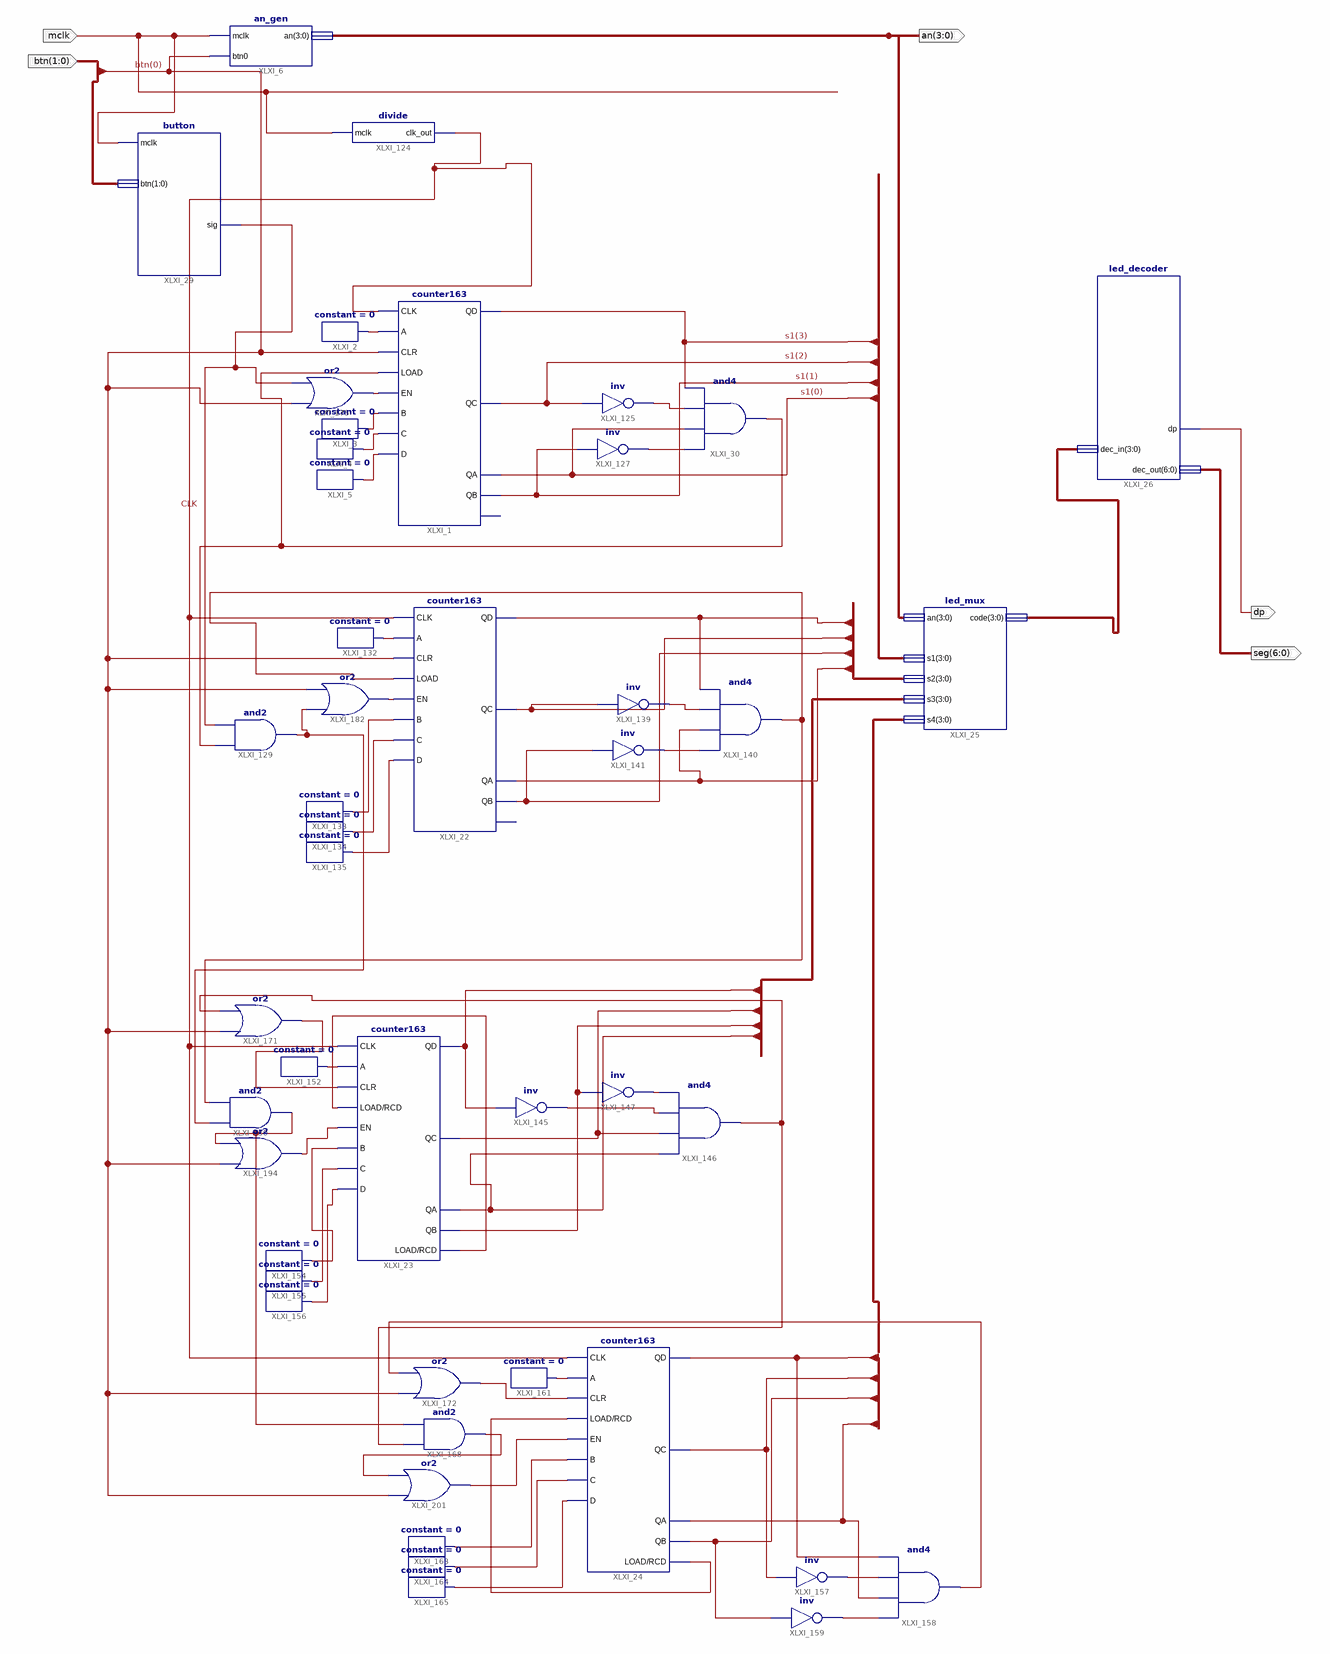
[diagram p0: schematic sheet 1]
// Xilinx ISE schematic timer.sch (spartan3e) as structural Verilog: 46 symbols, 5 ports
module timer (
  input  [1:0] btn,
  input  mclk,
  output [3:0] an,
  output dp,
  output [6:0] seg
);

  wire CLK, XLXN_4, XLXN_5, XLXN_6, XLXN_354, XLXN_396, XLXN_397, XLXN_410, XLXN_415, XLXN_416, XLXN_417,
       XLXN_419, XLXN_420, XLXN_429, XLXN_435, XLXN_437, XLXN_440, XLXN_441, XLXN_442, XLXN_443, XLXN_447,
       XLXN_448, XLXN_453, XLXN_454, XLXN_455, XLXN_456, XLXN_462, XLXN_467, XLXN_474, XLXN_477, XLXN_485,
       XLXN_487, XLXN_488, XLXN_489, XLXN_505, XLXN_513, XLXN_523, XLXN_538, XLXN_540, XLXN_559, XLXN_560;
  wire [3:0] s1, s2, s3, s4, XLXN_27;

  an_gen XLXI_6 (.mclk(mclk), .btn0(btn[0]), .an(an));
  button XLXI_29 (.mclk(mclk), .btn(btn), .sig(XLXN_467));
  led_decoder XLXI_26 (.dec_in(XLXN_27), .dp(dp), .dec_out(seg));
  led_mux XLXI_25 (.an(an), .code(XLXN_27), .s1(s1), .s2(s2), .s3(s3), .s4(s4));
  counter163 XLXI_24 (
    .CLK(CLK), .A(XLXN_453), .CLR(XLXN_488), .LOAD(XLXN_462), .EN(XLXN_560), .B(XLXN_454), .C(XLXN_455),
    .D(XLXN_456), .QD(s4[3]), .QC(s4[2]), .QA(s4[0]), .QB(s4[1]), .RCD(XLXN_462));
  counter163 XLXI_23 (
    .CLK(CLK), .A(XLXN_437), .CLR(XLXN_485), .LOAD(XLXN_443), .EN(XLXN_540), .B(XLXN_440), .C(XLXN_441),
    .D(XLXN_442), .QD(s3[3]), .QC(s3[2]), .QA(s3[0]), .QB(s3[1]), .RCD(XLXN_443));
  counter163 XLXI_22 (
    .CLK(CLK), .A(XLXN_410), .CLR(btn[0]), .LOAD(XLXN_477), .EN(XLXN_513), .B(XLXN_415), .C(XLXN_416),
    .D(XLXN_417), .QD(s2[3]), .QC(s2[2]), .QA(s2[0]), .QB(s2[1]));  // open: RCD
  constant #(.CValue("0")) XLXI_5 (.O(XLXN_6));
  constant #(.CValue("0")) XLXI_4 (.O(XLXN_5));
  constant #(.CValue("0")) XLXI_3 (.O(XLXN_4));
  constant #(.CValue("0")) XLXI_2 (.O(XLXN_354));
  counter163 XLXI_1 (
    .CLK(CLK), .A(XLXN_354), .CLR(btn[0]), .LOAD(XLXN_474), .EN(XLXN_505), .B(XLXN_4), .C(XLXN_5),
    .D(XLXN_6), .QD(s1[3]), .QC(s1[2]), .QA(s1[0]), .QB(s1[1]));  // open: RCD
  divide XLXI_124 (.mclk(mclk), .clk_out(CLK));
  not XLXI_125 (XLXN_397, s1[2]);
  and XLXI_30 (XLXN_474, XLXN_396, s1[0], XLXN_397, s1[3]);
  not XLXI_127 (XLXN_396, s1[1]);
  constant #(.CValue("0")) XLXI_132 (.O(XLXN_410));
  not XLXI_139 (XLXN_420, s2[2]);
  and XLXI_140 (XLXN_477, XLXN_419, s2[0], XLXN_420, s2[3]);
  not XLXI_141 (XLXN_419, s2[1]);
  and XLXI_146 (XLXN_435, s3[0], s3[2], XLXN_429, XLXN_489);
  not XLXI_145 (XLXN_429, s3[3]);
  constant #(.CValue("0")) XLXI_152 (.O(XLXN_437));
  not XLXI_157 (XLXN_448, s4[2]);
  and XLXI_158 (XLXN_487, XLXN_447, s4[0], XLXN_448, s4[3]);
  not XLXI_159 (XLXN_447, s4[1]);
  constant #(.CValue("0")) XLXI_161 (.O(XLXN_453));
  and XLXI_130 (XLXN_538, XLXN_523, XLXN_477);
  and XLXI_168 (XLXN_559, XLXN_435, XLXN_538);
  or XLXI_171 (XLXN_485, btn[0], XLXN_435);
  or XLXI_172 (XLXN_488, btn[0], XLXN_487);
  not XLXI_147 (XLXN_489, s3[1]);
  or XLXI_175 (XLXN_505, btn[0], XLXN_467);
  constant #(.CValue("0")) XLXI_133 (.O(XLXN_415));
  constant #(.CValue("0")) XLXI_134 (.O(XLXN_416));
  constant #(.CValue("0")) XLXI_135 (.O(XLXN_417));
  or XLXI_182 (XLXN_513, XLXN_523, btn[0]);
  and XLXI_129 (XLXN_523, XLXN_474, XLXN_467);
  constant #(.CValue("0")) XLXI_154 (.O(XLXN_440));
  constant #(.CValue("0")) XLXI_155 (.O(XLXN_441));
  constant #(.CValue("0")) XLXI_156 (.O(XLXN_442));
  or XLXI_194 (XLXN_540, btn[0], XLXN_538);
  constant #(.CValue("0")) XLXI_163 (.O(XLXN_454));
  constant #(.CValue("0")) XLXI_164 (.O(XLXN_455));
  constant #(.CValue("0")) XLXI_165 (.O(XLXN_456));
  or XLXI_201 (XLXN_560, btn[0], XLXN_559);
endmodule
